# EAGLE schematic power-test-linear (EAGLE 9.3.1)
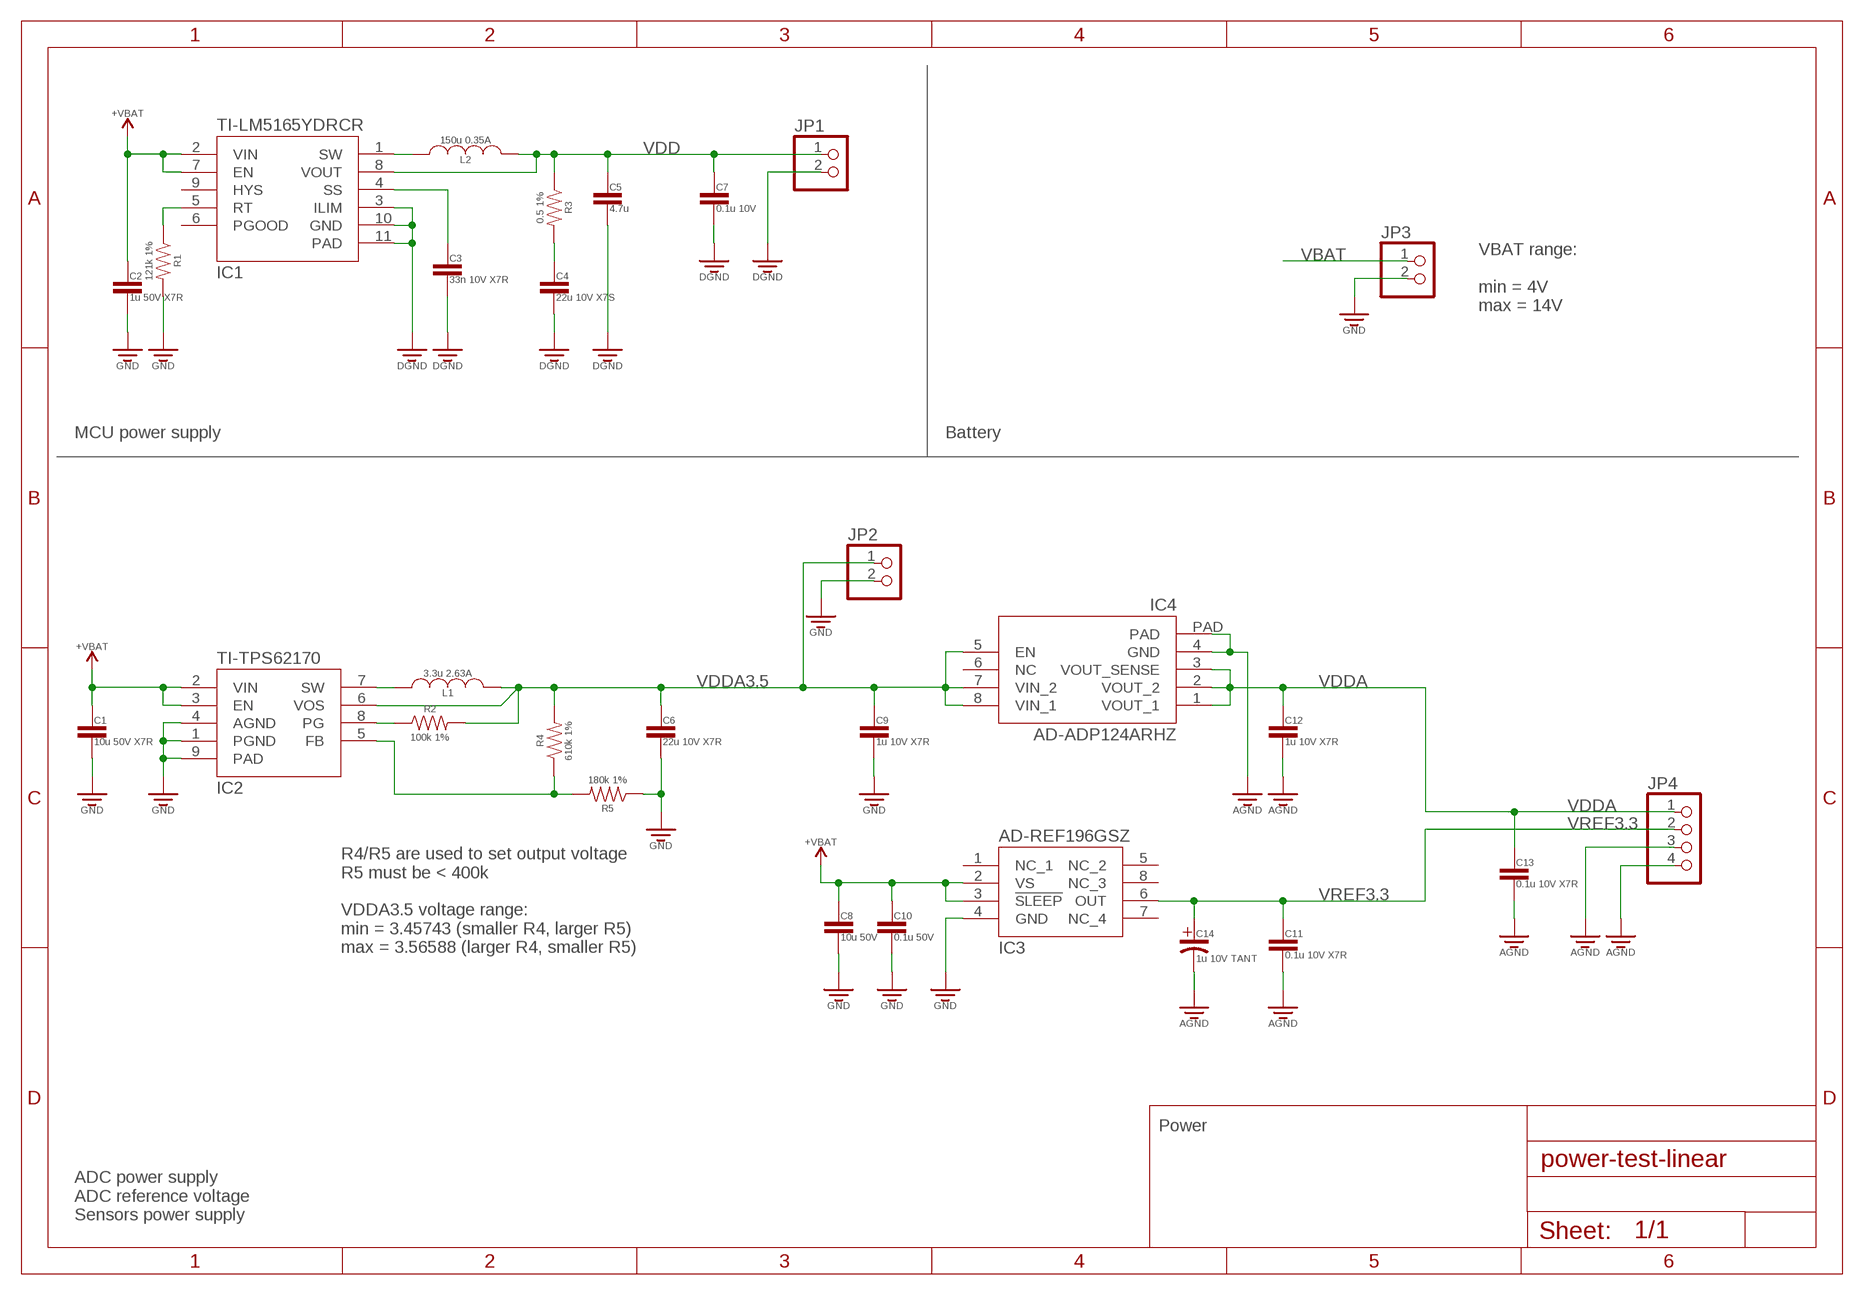
[diagram p0: schematic, sheet 1]

## Parts
C1  10u 50V X7R  CAPACITOR0805  [CAPACITOR-0805]
C2  1u 50V X7R  CAPACITOR1206  [CAPACITOR-1206]
C3  33n 10V X7R  CAPACITOR0603  [CAPACITOR-0603]
C4  22u 10V X7S  CAPACITOR0805  [CAPACITOR-0805]
C5  4.7u  CAPACITOR0805  [CAPACITOR-0805]
C6  22u 10V X7R  CAPACITOR0805  [CAPACITOR-0805]
C7  0.1u 10V  CAPACITOR0805  [CAPACITOR-0805]
C8  10u 50V  CAPACITOR0805  [CAPACITOR-0805]
C9  1u 10V X7R  CAPACITOR0805  [CAPACITOR-0805]
C10  0.1u 50V  CAPACITOR0805  [CAPACITOR-0805]
C11  0.1u 10V X7R  CAPACITOR0805  [CAPACITOR-0805]
C12  1u 10V X7R  CAPACITOR0805  [CAPACITOR-0805]
C13  0.1u 10V X7R  CAPACITOR0805  [CAPACITOR-0805]
C14  1u 10V TANT  CAPACITOR_POLARIZED  [CAPACITOR_POLARIZED-1411-(3528-MET)]
IC1  TI-LM5165YDRCR  [VSON-10-0.5MM]
IC2  TI-TPS62170  [WSON-8-0.5MM]
IC3  AD-REF196GSZ  [SOIC-8]
IC4  AD-ADP124ARHZ  [MSOP-8-EP]
JP1  PINHD-1X2  [1X02]
JP2  PINHD-1X2  [1X02]
JP3  PINHD-1X2  [1X02]
JP4  PINHD-1X4  [1X04]
L1  3.3u 2.63A  VLS3012HBX  [VLS3012HBX]
L2  150u 0.35A  ELL-6SH151M  [ELL-6SH151M]
R1  121k 1%  RESISTOR_0.1W  [RESISTOR-0603]
R2  100k 1%  RESISTOR_0.1W  [RESISTOR-0603]
R3  0.5 1%  RESISTOR_0.1W  [RESISTOR-0603]
R4  610k 1%  RESISTOR_0.1W  [RESISTOR-0603]
R5  180k 1%  RESISTOR_0.1W  [RESISTOR-0603]
SUPPLY1  +VBAT  (no package)
SUPPLY2  +VBAT  (no package)
SUPPLY3  +VBAT  (no package)

## Nets
AGND [ground]: C11.2 C12.2 C13.2 C14.NEG IC4.4(GND) IC4.PAD JP4.3 JP4.4
DGND: C3.2 C4.2 C5.2 C7.2 IC1.3(ILIM) IC1.10(GND) IC1.11(PAD) JP1.2
GND: C1.2 C2.P$2 C6.2 C8.2 C9.2 C10.2 IC2.1(PGND) IC2.4(AGND) IC2.9(PAD) IC3.4(GND) JP2.2 JP3.2 R1.P$2 R5.P$1
N$26: IC2.7(SW) L1.1
N$27: IC2.8(PG) R2.P$1
N$28: C3.1 IC1.4(SS)
N$29: IC1.1(SW) L2.1
N$30: IC1.5(RT) R1.P$1
N$31: IC2.5(FB) R4.P$1 R5.P$2
N$32: C4.1 R3.P$2
VBAT: C1.1 C2.P$1 C8.1 C10.1 IC1.2(VIN) IC1.7(EN) IC2.2(VIN) IC2.3(EN) IC3.2(VS) IC3.3(!SLEEP) JP3.1 SUPPLY1.VCC SUPPLY2.VCC SUPPLY3.VCC
VDD: C5.1 C7.1 IC1.8(VOUT) JP1.1 L2.2 R3.P$1
VDDA: C12.1 C13.1 IC4.1(VOUT_1) IC4.2(VOUT_2) IC4.3(VOUT_SENSE) JP4.1
VDDA3.5: C6.1 C9.1 IC2.6(VOS) IC4.5(EN) IC4.7(VIN_2) IC4.8(VIN_1) JP2.1 L1.2 R2.P$2 R4.P$2
VREF3.3: C11.1 C14.POS IC3.6(OUT) JP4.2
Unconnected: IC1.6(PGOOD) IC1.9(HYS) IC3.1(NC_1) IC3.5(NC_2) IC3.7(NC_4) IC3.8(NC_3) IC4.6(NC)

## Notes on the sheet
- VBAT range:
  
  min = 4V
  max = 14V
- MCU power supply | Battery
- R4/R5 are used to set output voltage
  R5 must be < 400k
  
  VDDA3.5 voltage range:
  min = 3.45743 (smaller R4, larger R5)
  max = 3.56588 (larger R4, smaller R5)
- Power
- ADC power supply
  ADC reference voltage
  Sensors power supply

## Library data of the parts
C1-C13 = capacitors:CAPACITOR
C14 = capacitors:CAPACITOR_POLARIZED
IC1 = voltage-source:TI-LM5165YDRCR
IC2 = voltage-source:TI-TPS62170
IC3 = voltage-source:AD-REF196GSZ
IC4 = voltage-source:AD-ADP124ARHZ
JP1-JP3 = pin-headers:PINHD-1X2: PIN HEADER
JP4 = pin-headers:PINHD-1X4: PIN HEADER
L1 = inductors:VLS3012HBX
L2 = inductors:ELL-6SH151M
R1-R5 = resistors:RESISTOR_0.1W
SUPPLY1-SUPPLY3 = voltage-ground:+VBAT: +3.3V Voltage Supply Positive voltage supply (traditionally for a BJT device, C=collector).

## Net classes
1 ground: width 0.3 mm
2 3v3: width 0.3 mm